# Altium project flbot.PrjPcb
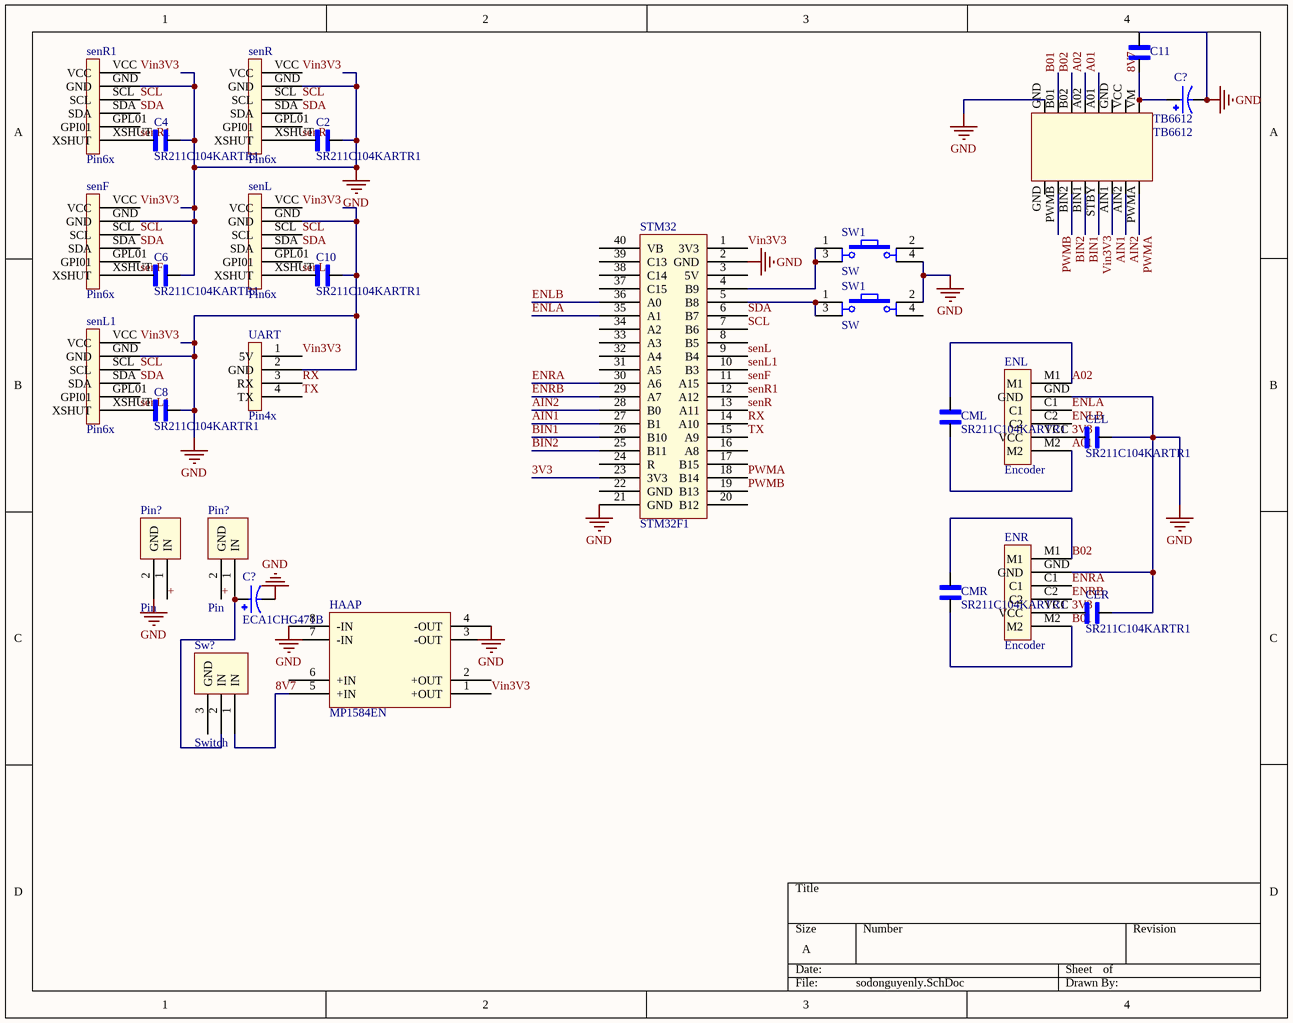
[diagram p0: sodonguyenly.SchDoc]
1 sheet, 28 parts. Net scope: global (net labels, ports and power ports of the same name join across sheets).
Board file: PCB1.PcbDoc

## Sheet sodonguyenly.SchDoc
size A; SheetNumber: 1; SheetTotal: 1

### Parts
(Parts that share a designator on the sheet are numbered #1, #2 ... from top to bottom, then left to right.)
C2  SR211C104KARTR1  [CAPRR508W50L508T317H508]
C4  SR211C104KARTR1  [CAPRR508W50L508T317H508]
C6  SR211C104KARTR1  [CAPRR508W50L508T317H508]
C8  SR211C104KARTR1  [CAPRR508W50L508T317H508]
C10  SR211C104KARTR1  [CAPRR508W50L508T317H508]
C11  SR211C104KARTR1  [CAPRR508W50L508T317H508]  (value not drawn)
C?#1  ECA1CHG471B  [CAPPRD500W60D800H1150]  (value not drawn)
C?#2  ECA1CHG471B  [CAPPRD500W60D800H1150]
CEL  SR211C104KARTR1  [CAPRR508W50L508T317H508]
CER  SR211C104KARTR1  [CAPRR508W50L508T317H508]
CML  SR211C104KARTR1  [CAPRR508W50L508T317H508]
CMR  SR211C104KARTR1  [CAPRR508W50L508T317H508]
ENL  Encoder  [Encoder]
ENR  Encoder  [Encoder]
HAAP  MP1584EN  [MP1584EN]
Pin?#1  Pin  [Pin]
Pin?#2  Pin  [Pin]
senF  Pin6x  [Pin6X]
senL  Pin6x  [Pin6X]
senL1  Pin6x  [Pin6X]
senR  Pin6x  [Pin6X]
senR1  Pin6x  [Pin6X]
STM32  STM32F1  [STM32F1]
SW1#1  SW  [SW4]
SW1#2  SW  [SW4]
Sw?  Switch  [Switch]
TB6612  TB6612  [TB6612]
UART  Pin4x  [Pin4x]

### Nets
GND: C2.2 C4.2 C6.2 C8.2 C10.2 C11.2 C?#1.N C?#2.N CEL.2 CER.2 ENL.GND ENR.GND HAAP.4(-OUT) HAAP.8(-IN) Pin?#1.2(GND) senF.GND senL.GND senL1.GND senR.GND senR1.GND STM32.2(GND) STM32.21(GND) SW1#1.4 SW1#2.2 TB6612.GND UART.2(GND)
3V3: CEL.1 CER.1 ENL.VCC ENR.VCC STM32.23(3V3)
8V7: C11.1 C?#1.P HAAP.5(+IN) Sw?.1(IN) TB6612.VM
+: Pin?#1.1(IN) Pin?#2.2(GND)
A01: CML.1 ENL.M2 TB6612.A01
A02: CML.2 ENL.M1 TB6612.A02
AIN1: STM32.27(B1) TB6612.AIN1
AIN2: STM32.28(B0) TB6612.AIN2
B01: CMR.1 ENR.M2 TB6612.B01
B02: CMR.2 ENR.M1 TB6612.B02
BIN1: STM32.26(B10) TB6612.BIN1
BIN2: STM32.25(B11) TB6612.BIN2
ENLA: ENL.C1 STM32.35(A1)
ENLB: ENL.C2 STM32.36(A0)
ENRA: ENR.C1 STM32.30(A6)
ENRB: ENR.C2 STM32.29(A7)
PWMA: STM32.18(B14) TB6612.PWMA
PWMB: STM32.19(B13) TB6612.PWMB
RX: STM32.14(A10) UART.3(RX)
SCL: senF.SCL senL.SCL senL1.SCL senR.SCL senR1.SCL STM32.7(B6)
SDA: senF.SDA senL.SDA senL1.SDA senR.SDA senR1.SDA STM32.6(B7)
senF: C6.1 senF.XSHUT STM32.11(A15)
senL: C10.1 senL.XSHUT STM32.9(B4)
senL1: C8.1 senL1.XSHUT STM32.10(B3)
senR: C2.1 senR.XSHUT STM32.13(A11)
senR1: C4.1 senR1.XSHUT STM32.12(A12)
TX: STM32.15(A9) UART.4(TX)
Vin3V3: HAAP.1(+OUT) senF.VCC senL.VCC senL1.VCC senR.VCC senR1.VCC STM32.1(3V3) TB6612.STBY UART.1(5V)
NetC?#2_P: C?#2.P Pin?#2.1(IN) Sw?.2(IN)
NetSTM32_4: STM32.4(B9) SW1#1.1 SW1#1.3
NetSTM32_5: STM32.5(B8) SW1#2.1 SW1#2.3

Not connected (* = marked no-connect by the designer): HAAP 2(+OUT) 3(-OUT) 6(+IN) 7(-IN); senF GPL01(GPI01); senL GPL01(GPI01); senL1 GPL01(GPI01); senR GPL01(GPI01); senR1 GPL01(GPI01); STM32 3(5V) 8(B5) 16(A8) 17(B15) 20(B12) 22(GND) 24(R) 31(A5) 32(A4) 33(A3) 34(A2) 37(C15) 38(C14) 39(C13) 40(VB); SW1#1 2; SW1#2 4; Sw? 3(GND); TB6612 VCC

### Library data of the parts
C2 C4 C6 C8 C10 C11 CEL CER CML CMR = SR211C104KARTR1: 0.1 ÂµF Â±10% 100V Ceramic Capacitor X7R Radial; MF: AVX; SnapEDA_Link: https://www.snapeda.com/parts/SR211C104KARTR1/AVX/view-part/?ref=snap; Package: Radial AVX Interconnect / Elco; Value: *; MP: SR211C104KARTR1; Check_prices: https://www.snapeda.com/parts/SR211C104KARTR1/AVX/view-part/?ref=eda
C?#1 C?#2 = ECA1CHG471B: NHG-A; Price: None; Value: *; MP: ECA1CHG471B; Availability: Unavailable; Package: None
SW1#1 SW1#2 = SW4: Switch button 4 pin; Value: Button chip 4 pin